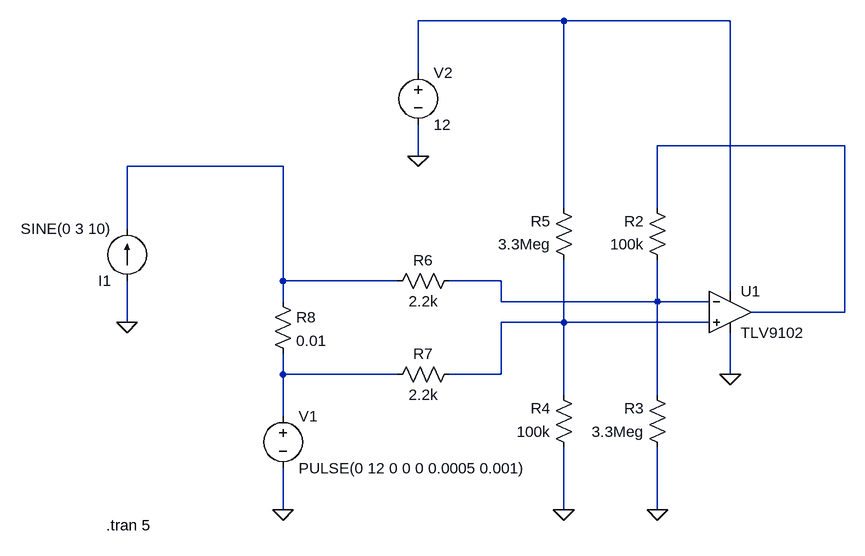
[diagram p0: schematic I_sense_hi_V_simple.asc]
I_sense_hi_V_simple.asc, the LTspice schematic file:
Version 4
SHEET 1 1060 680
WIRE 0 -272 -224 -272
WIRE 256 -272 0 -272
WIRE -224 -192 -224 -272
WIRE 432 -80 144 -80
WIRE -224 -64 -224 -112
WIRE -432 -48 -672 -48
WIRE 0 16 0 -272
WIRE 144 16 144 -80
WIRE -672 48 -672 -48
WIRE -432 128 -432 -48
WIRE -256 128 -432 128
WIRE -96 128 -176 128
WIRE 256 144 256 -272
WIRE -432 160 -432 128
WIRE -96 160 -96 128
WIRE 144 160 144 96
WIRE 144 160 -96 160
WIRE 224 160 144 160
WIRE 432 176 432 -80
WIRE 432 176 288 176
WIRE -672 192 -672 128
WIRE 0 192 0 96
WIRE 0 192 -96 192
WIRE 224 192 0 192
WIRE -432 272 -432 240
WIRE -256 272 -432 272
WIRE -96 272 -96 192
WIRE -96 272 -176 272
WIRE 256 272 256 208
WIRE 0 304 0 192
WIRE 144 304 144 160
WIRE -432 336 -432 272
WIRE -432 480 -432 416
WIRE 0 480 0 384
WIRE 144 480 144 384
FLAG -432 480 0
FLAG 0 480 0
FLAG 144 480 0
FLAG 256 272 0
FLAG -224 -64 0
FLAG -672 192 0
SYMBOL res 160 112 R180
WINDOW 0 36 76 Left 2
WINDOW 3 36 40 Left 2
SYMATTR InstName R2
SYMATTR Value 100k
SYMBOL res 160 400 R180
WINDOW 0 36 76 Left 2
WINDOW 3 36 40 Left 2
SYMATTR InstName R3
SYMATTR Value 3.3Meg
SYMBOL res 16 400 R180
WINDOW 0 36 76 Left 2
WINDOW 3 36 40 Left 2
SYMATTR InstName R4
SYMATTR Value 100k
SYMBOL res 16 112 R180
WINDOW 0 36 76 Left 2
WINDOW 3 36 40 Left 2
SYMATTR InstName R5
SYMATTR Value 3.3Meg
SYMBOL res -272 144 R270
WINDOW 0 32 56 VTop 2
WINDOW 3 0 56 VBottom 2
SYMATTR InstName R6
SYMATTR Value 2.2k
SYMBOL res -272 288 R270
WINDOW 0 32 56 VTop 2
WINDOW 3 0 56 VBottom 2
SYMATTR InstName R7
SYMATTR Value 2.2k
SYMBOL res -448 144 R0
SYMATTR InstName R8
SYMATTR Value 0.01
SYMBOL voltage -432 320 R0
WINDOW 123 0 0 Left 0
WINDOW 39 0 0 Left 0
SYMATTR InstName V1
SYMATTR Value PULSE(0 12 0 0 0 0.0005 0.001)
SYMBOL voltage -224 -208 R0
WINDOW 123 0 0 Left 0
WINDOW 39 0 0 Left 0
SYMATTR InstName V2
SYMATTR Value 12
SYMBOL current -672 128 R180
WINDOW 123 0 0 Left 0
WINDOW 39 0 0 Left 0
SYMATTR InstName I1
SYMATTR Value SINE(0 3 10)
SYMBOL Custom\\TLV9102 256 112 R0
SYMATTR InstName U1
TEXT -704 504 Left 2 !.tran 5

The netlist it stands for:
* I_sense_hi_V_simple.asc
R2 N004 N002 100k
R3 0 N004 3.3Meg
R4 0 N005 100k
R5 N005 N001 3.3Meg
R6 N003 N004 2.2k
R7 N006 N005 2.2k
R8 N003 N006 0.01
V1 N006 0 PULSE(0 12 0 0 0 0.0005 0.001)
V2 N001 0 12
I1 0 N003 SINE(0 3 10)
* U1: TLV9102 (symbol Custom\TLV9102 not available, pins judged from their places): In+=N005 In-=N004 V+=N001 V-=0 OUT=N002
.tran 5
.backanno
.end